# EasyEDA Pro project TTMT_ENTIRE_EASYEDA_PROJECT.epro, schematic panelschematic, sheet 1 of 3

## Sheets
1 P1: Board Name: panel; Create Date: 2026-05-15; Page Name: P1; Project Name: To The Moon Together - An Amateur Sounding Rocket; Schematic Name: panelschematic; Update Date: 2026-05-14; Company: EasyEDA.com; Page Size: A4; Version: V1.0
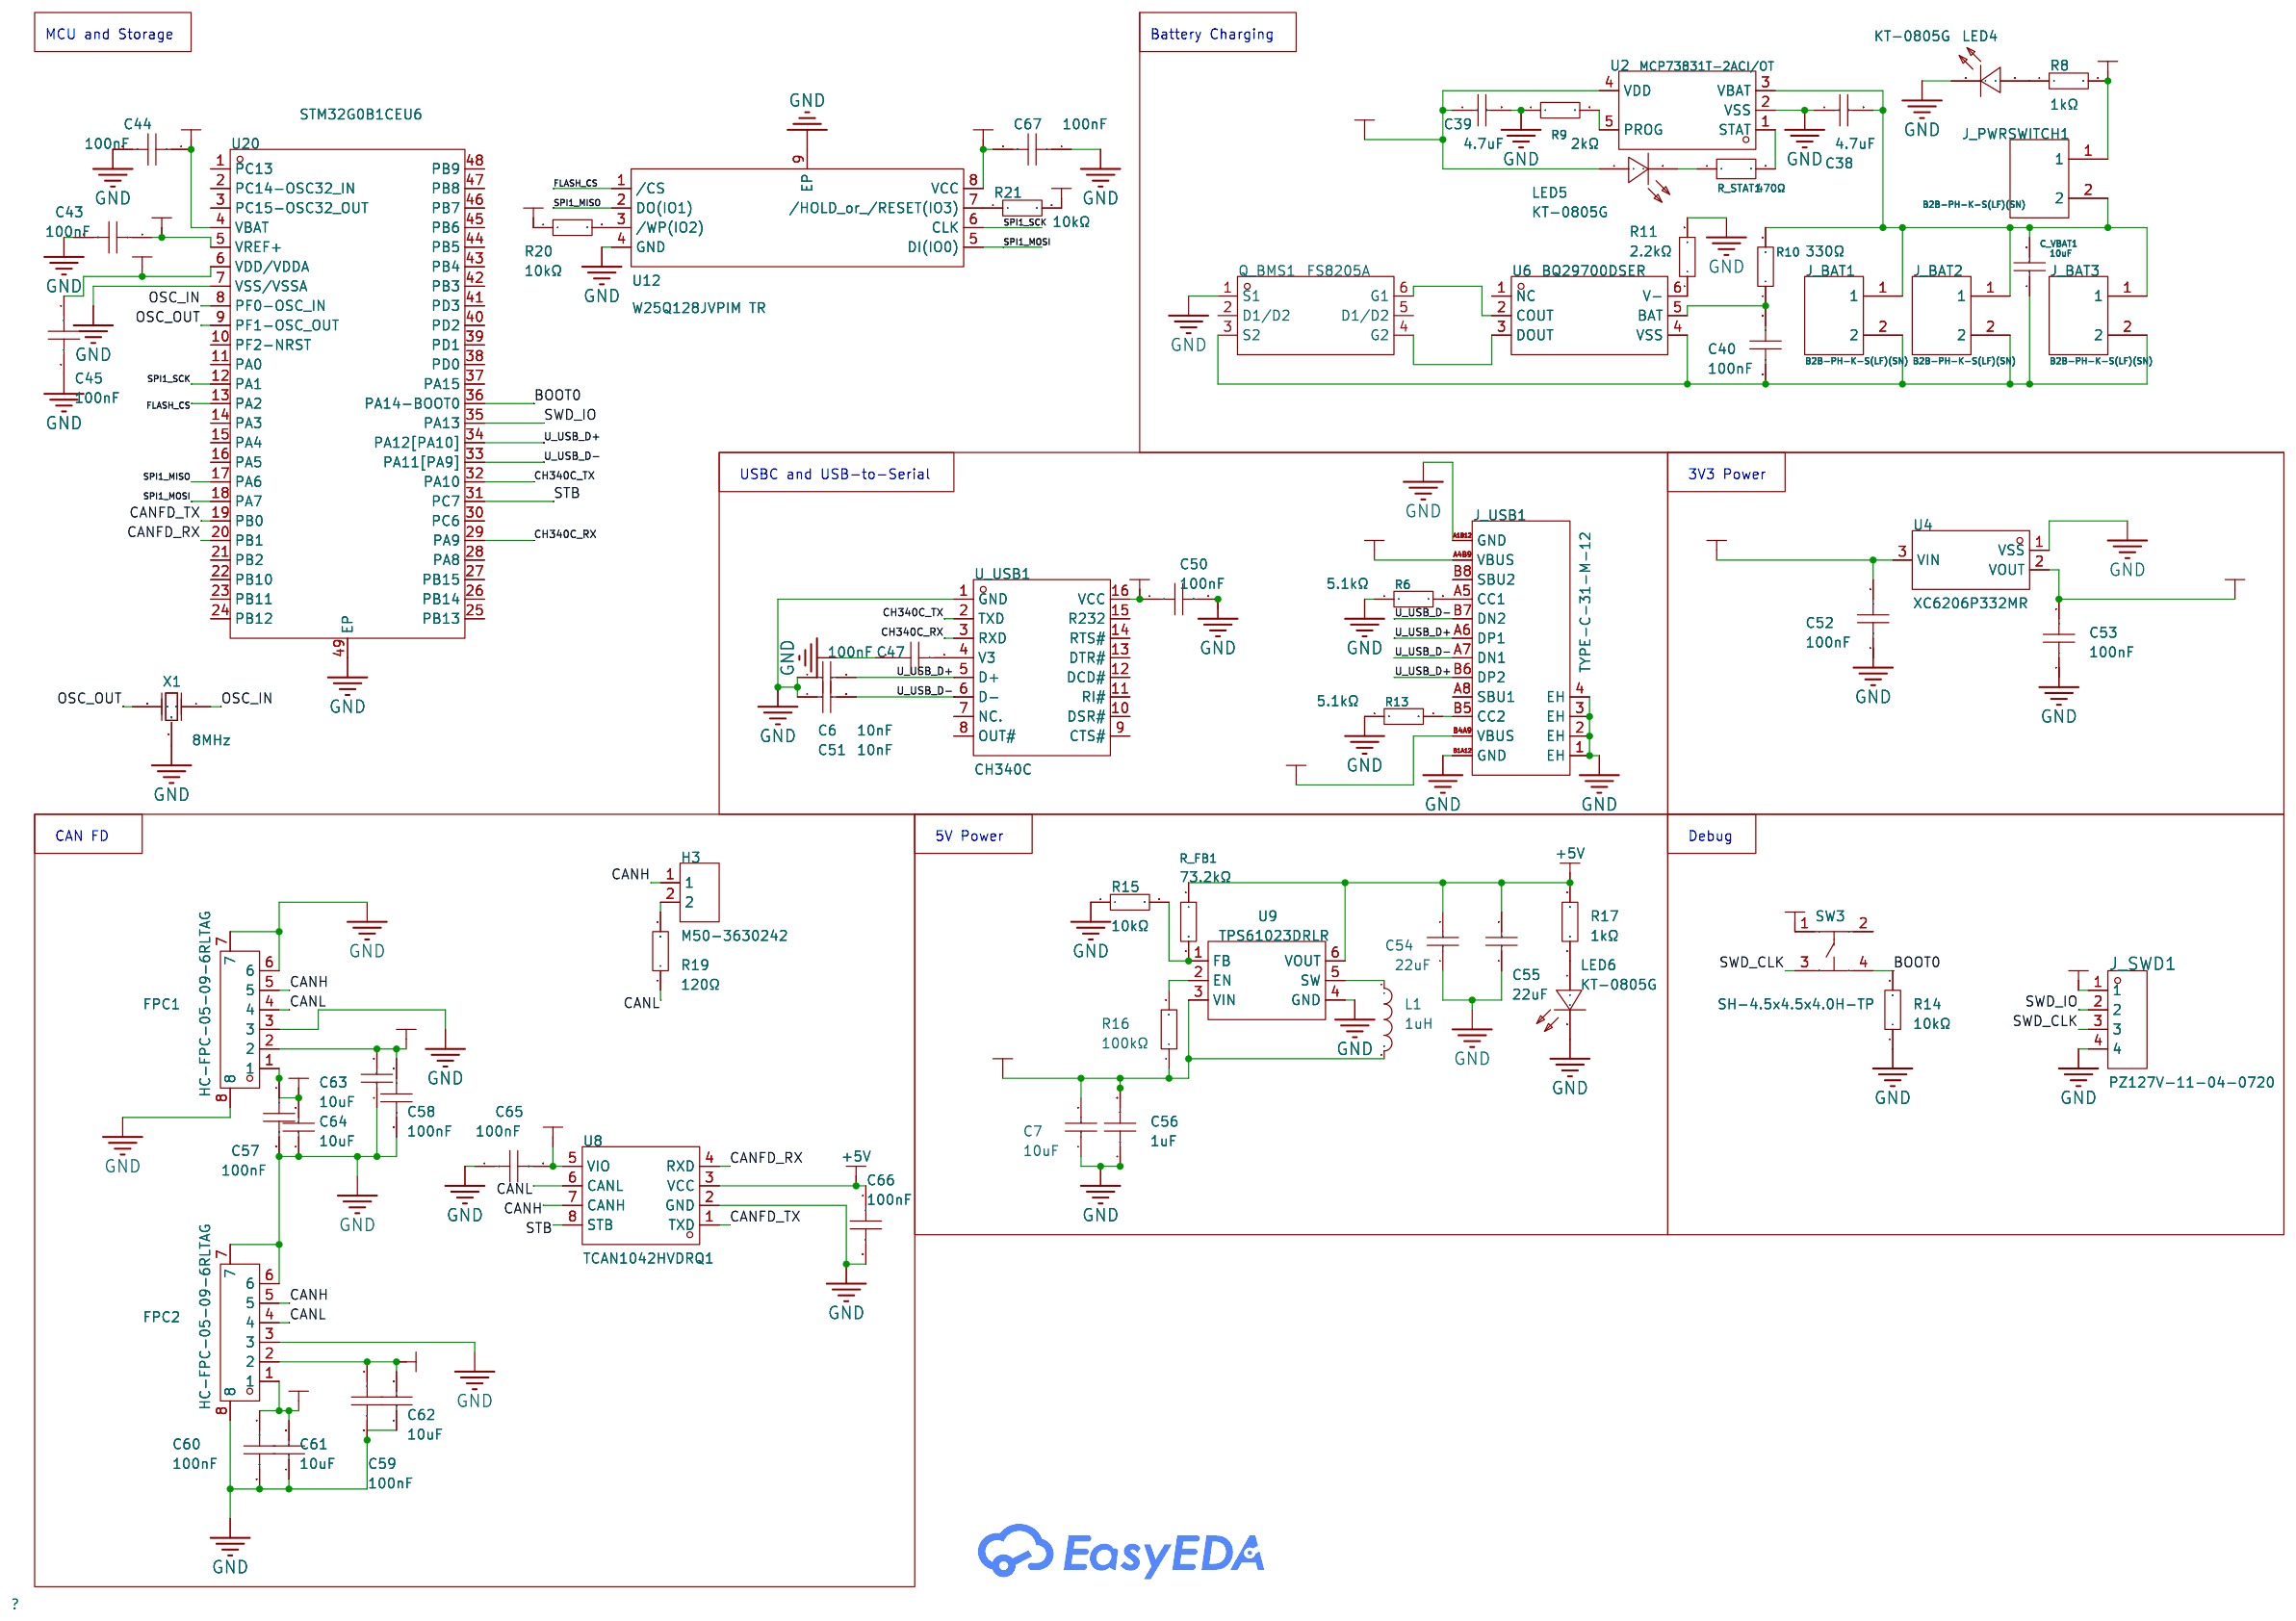
[diagram p5: P1]

## Parts
C6  10nF  [C0402]
C7  10uF  [C0402]
C38  4.7uF  [C1206]
C39  4.7uF  [C1206]
C40  100nF  [C0402]
C43  100nF  [C0402]
C44  100nF  [C0402]
C45  100nF  [C0402]
C47  100nF  [C0402]
C50  100nF  [C0402]
C51  10nF  [C0402]
C52  100nF  [C0402]
C53  100nF  [C0402]
C54  22uF  [C1206]
C55  22uF  [C1206]
C56  1uF  [C0402]
C57  100nF  [C0402]
C58  100nF  [C0402]
C59  100nF  [C0402]
C60  100nF  [C0402]
C61  10uF  [C0402]
C62  10uF  [C0402]
C63  10uF  [C0402]
C64  10uF  [C0402]
C65  100nF  [C0402]
C66  100nF  [C0402]
C67  100nF  [C0402]
C_VBAT1  10uF  [C0402]
FPC1  HC-FPC-05-09-6RLTAG  [FPC-SMD_6P-P0.50_HC-FPC-05-09-6RLTAG]
FPC2  HC-FPC-05-09-6RLTAG  [FPC-SMD_6P-P0.50_HC-FPC-05-09-6RLTAG]
H3  M50-3630242  [HDR-SMD_2P-P1.27_M50-3630242]
J_BAT1  B2B-PH-K-S(LF)(SN)  [CONN-TH_B2B-PH-K-S]
J_BAT2  B2B-PH-K-S(LF)(SN)  [CONN-TH_B2B-PH-K-S]
J_BAT3  B2B-PH-K-S(LF)(SN)  [CONN-TH_B2B-PH-K-S]
J_PWRSWITCH1  B2B-PH-K-S(LF)(SN)  [CONN-TH_B2B-PH-K-S]
J_SWD1  PZ127V-11-04-0720  [HDR-TH_4P-P1.27-V-M]
J_USB1  TYPE-C-31-M-12  [USB-C_SMD-TYPE-C-31-M-12_1]
L1  1uH  [L0603]
LED4  KT-0805G  [LED0805-R-RD]
LED5  KT-0805G  [LED0805-R-RD]
LED6  KT-0805G  [LED0805-R-RD]
Q_BMS1  FS8205A  [SOT-23-6_L2.9-W1.6-P0.95-LS2.8-BR]
R6  5.1kΩ  [R0402]
R8  1kΩ  [R0402]
R9  2kΩ  [R0402]
R10  330Ω  [R0805]
R11  2.2kΩ  [R0805]
R13  5.1kΩ  [R0402]
R14  10kΩ  [R0402]
R15  10kΩ  [R0402]
R16  100kΩ  [R1206]
R17  1kΩ  [R0402]
R19  120Ω  [R0402]
R20  10kΩ  [R0402]
R21  10kΩ  [R0402]
R_FB1  73.2kΩ  [R0402]
R_STAT1  470Ω  [R0402]
SW3  SH-4.5x4.5x4.0H-TP  [SW-SMD_4P-SH-4.5X4.5X4.0H-TP]
U2  MCP73831T-2ACI/OT  [SOT-23-5_L3.0-W1.7-P0.95-LS2.8-BL]
U4  XC6206P332MR  [SOT-23-3_L3.0-W1.7-P0.95-LS2.9-BR]
U6  BQ29700DSER  [WSON-6_L1.5-W1.5-P0.50-TL]
U8  TCAN1042HVDRQ1  [SOIC-8_L4.9-W3.9-P1.27-LS6.0-BL]
U9  TPS61023DRLR  [SOT-563_L1.6-W1.2-P0.50-LS1.6-BR]
U12  W25Q128JVPIM TR  [WSON-8_L6.0-W5.0-P1.27-BL-EP]
U20  STM32G0B1CEU6  [UFQFPN-48_L7.0-W7.0-P0.50-BL-EP]
U_USB1  CH340C  [SOP-16_L10.0-W3.9-P1.27-LS6.0-BL]
X1  8MHz  [OSC-SMD_3P-L3.2-W1.3-P1.20-L]

## Library data of the parts
C6 C51 = CL05B103KB5NNNC: Capacitance:10nF Tolerance:±10% Tolerance:±10% Voltage Rating:50V Temperature Coefficient:X7R; LCSC Part Name: 10nF ±10% 50V; Supplier Part: C15195; Manufacturer: SAMSUNG(三星); Supplier Footprint: 0402; JLCPCB Part Class: Basic Part; Datasheet: https://item.szlcsc.com/datasheet/CL05B103KB5NNNC/15869.html; Supplier: LCSC; Tolerance: ±10%; Voltage Rating: 50V; Temperature Coefficient: X7R
C7 C61-C64 C_VBAT1 = CL05A106MQ5NUNC: Capacitance:10uF Tolerance:±20% Tolerance:±20% Voltage Rating:6.3V Temperature Coefficient:X5R; LCSC Part Name: 10uF ±20% 6.3V; Supplier Part: C15525; Manufacturer: SAMSUNG(三星); Supplier Footprint: 0402; JLCPCB Part Class: Basic Part; Datasheet: https://item.szlcsc.com/datasheet/CL05A106MQ5NUNC/16204.html; Supplier: LCSC; Tolerance: ±20%; Voltage Rating: 6.3V; Temperature Coefficient: X5R
C38 C39 = CL31B475KAHNNNE: Capacitance:4.7uF Tolerance:±10% Tolerance:±10% Voltage Rating:25V Temperature Coefficient:X7R; LCSC Part Name: 4.7uF ±10% 25V; Supplier Part: C1872; Manufacturer: SAMSUNG(三星); Supplier Footprint: 1206; JLCPCB Part Class: Extended Part; Datasheet: https://item.szlcsc.com/datasheet/CL31B475KAHNNNE/2224.html; Supplier: LCSC; Tolerance: ±10%; Voltage Rating: 25V; Temperature Coefficient: X7R
C40 C43-C45 C47 C50 C52 C53 C57-C60 C65-C67 = CL05B104KO5NNNC: Capacitance:100nF Tolerance:±10% Tolerance:±10% Voltage Rating:16V Temperature Coefficient:X7R; LCSC Part Name: 100nF ±10% 16V; Supplier Part: C1525; Manufacturer: SAMSUNG(三星); Supplier Footprint: 0402; JLCPCB Part Class: Basic Part; Datasheet: https://item.szlcsc.com/datasheet/CL05B104KO5NNNC/1877.html; Supplier: LCSC; Tolerance: ±10%; Voltage Rating: 16V; Temperature Coefficient: X7R
C54 C55 = CL31A226KAHNNNE: Capacitance:22uF Tolerance:±10% Tolerance:±10% Voltage Rating:25V Temperature Coefficient:X5R; LCSC Part Name: 22uF ±10% 25V; Supplier Part: C12891; Manufacturer: SAMSUNG(三星); Supplier Footprint: 1206; JLCPCB Part Class: Basic Part; Datasheet: https://item.szlcsc.com/datasheet/CL31A226KAHNNNE/13537.html; Supplier: LCSC; Tolerance: ±10%; Voltage Rating: 25V; Temperature Coefficient: X5R
C56 = CL05A105KA5NQNC: Capacitance:1uF Tolerance:±10% Tolerance:±10% Voltage Rating:25V Temperature Coefficient:X5R; LCSC Part Name: 1uF ±10% 25V; Supplier Part: C52923; Manufacturer: SAMSUNG(三星); Supplier Footprint: 0402; JLCPCB Part Class: Basic Part; Datasheet: https://item.szlcsc.com/datasheet/CL05A105KA5NQNC/53938.html; Supplier: LCSC; Tolerance: ±10%; Voltage Rating: 25V; Temperature Coefficient: X5R
FPC1 FPC2 = HC-FPC-05-09-6RLTAG: Locking Feature:Hinged Lid Contact Type:Double-Sided Contacts, Top and Bottom Entry Number of Contacts:6P Pitch:0.5mm Mounting Type:Surface Mount, Right Angle FFC, FCB Thickness:0.3mm FFC, FCB Thickness:0.3mm Height Above Board:1mm Contact Material:Copper; LCSC Part Name: 翻盖式 双侧触点/上下接 P数:6P 间距:0.5mm; Supplier Part: C5213748; Manufacturer: HCTL(华灿天禄); Supplier Footprint: SMD,P=0.5mm,卧贴; JLCPCB Part Class: Extended Part; Datasheet: https://item.szlcsc.com/datasheet/HC-FPC-05-09-6RLTAG/5909040.html; Supplier: LCSC; Locking Feature: Hinged Lid; Contact Type: Double-Sided Contacts, Top and Bottom Entry; Number of Contacts: 6P; Pitch: 0.5mm; Mounting Type: Surface Mount, Right Angle; FFC, FCB Thickness: 0.3mm; Height Above Board: 1mm; Contact Material: Copper Alloy; Operating Temperature: -55℃~+85℃
H3 = M50-3630242: Pitch:1.27mm Row Spacing:- Circluar Pins/Square Pins:Pin Header Mounting Type:Surface Mount,Vertical Number of Rows:1 Number of Pins:2P Current Rating:1A Length of Mating Pin:3mm Insulation Height:1mm Length of End Connection Pin:- Contact Material:Brass; LCSC Part Name: 间距:1.27mm 方针 立贴; Supplier Part: C7297891; Manufacturer: Harwin; Supplier Footprint: SMD,P=1.27mm; JLCPCB Part Class: Extended Part; Datasheet: https://item.szlcsc.com/datasheet/M50-3630242/8267898.html; Supplier: LCSC; Pitch: 1.27mm; Circluar Pins/Square Pins: Pin Header; Mounting Type: Surface Mount,Vertical; Number of Rows: 1; Number of Pins: 2P; Current Rating: 1A; Length of Mating Pin: 3mm; Insulation Height: 1mm; Contact Material: Brass; Contact Plating: Tin; Operating Temperature: -40℃~+105℃; Color: Black
J_BAT1-J_BAT3 J_PWRSWITCH1 = B2B-PH-K-S(LF)(SN): Pins Structure:1x2P Pitch:2mm Mounting Type:Through Hole Reference Series:PH Number of Pins:2P Number of Rows:1 Number of PINs Per Row:2 Row Spacing:- Current Rating:2A Contact Material:Brass Contact Plating:Tin Operating Temperature:-25℃~+85℃ Operating T; LCSC Part Name: 1x2P 间距:2mm 直插 系列:PH; Supplier Part: C131337; Manufacturer: JST; Supplier Footprint: 插件,P=2mm; JLCPCB Part Class: Extended Part; Datasheet: https://item.szlcsc.com/datasheet/B2B-PH-K-S(LF)(SN)/142630.html; Supplier: LCSC; Pins Structure: 1x2P; Pitch: 2mm; Mounting Type: Through Hole; Reference Series: PH; Number of Pins: 2P; Number of Rows: 1; Number of PINs Per Row: 2; Current Rating: 2A; Contact Material: Brass; Contact Plating: Tin; Operating Temperature: -25℃~+85℃; Voltage Rating: 100V; Plastic Material: PA66; Flame Retardant Rating: UL94V-0; Supplementary Features: K Pin; Color: White; Z-Height of the Board: 6mm; X-Length of Bottom Edge on Board (Spacing Line): 5.9mm; Y-Width of Bottom Edge on Board: 4.5mm
J_SWD1 = PZ127V-11-04-0720: Pin Structure:1x4P Pitch:1.27mm Row Spacing:- Circluar Pins/Square Pins:Pin Header Mounting Type:Through Hole Number of Rows:1 Number of Pins:4P Current Rating:1A Voltage Rating (Max):- Length of Mating Pin:3.9mm Insulation Height:1mm Length of End Connec; LCSC Part Name: 1x4P 间距:1.27mm 方针 直插; Supplier Part: C541879; Manufacturer: XFCN(兴飞); Supplier Footprint: 插件,P=1.27mm; JLCPCB Part Class: Extended Part; Datasheet: https://item.szlcsc.com/datasheet/PZ127V-11-04-0720/562500.html; Supplier: LCSC; Pin Structure: 1x4P; Pitch: 1.27mm; Circluar Pins/Square Pins: Pin Header; Mounting Type: Through Hole; Number of Rows: 1; Number of Pins: 4P; Current Rating: 1A; Length of Mating Pin: 3.9mm; Insulation Height: 1mm; Length of End Connection Pin: 2.3mm; Contact Material: Brass; Operating Temperature: -40℃~+105℃; Color: Black
J_USB1 = TYPE-C-31-M-12: Connector Type:Type-C Protocol Standard:- Gender:Female Mounting Type:Surface Mount, Right Angle Number of Contacts:16P Number of Ports:1 Current Rating-Power:5A Voltage Rating:20V Connect-Disconnect Life:10,000 cycles Length:7.35mm Operating Temperature:; LCSC Part Name: Type-C 母 卧贴; Supplier Part: C165948; Manufacturer: 韩国韩荣; Supplier Footprint: SMD; JLCPCB Part Class: Extended Part; Datasheet: https://item.szlcsc.com/datasheet/TYPE-C-31-M-12/177331.html; Supplier: LCSC; Connector Type: Type-C; Gender: Female; Mounting Type: Surface Mount, Right Angle; Number of Contacts: 16P; Number of Ports: 1; Current Rating-Power: 5A; Voltage Rating: 20V; Connect-Disconnect Life: 10,000 cycles; Length: 7.35mm; Operating Temperature: -30℃~+80℃
L1 = YL160808-1R0K: Inductance:1uH Tolerance:±10% Tolerance:±10% Current Rating:25mA Current - Saturation (Isat):- DC Resistance(DCR):600mΩ Q @ Frequency:35@10MHz Frequency - Self Resonant:75MHz Ratings:-; LCSC Part Name: 1uH ±10%; Supplier Part: C2839970; Manufacturer: YJYCOIN(益嘉源); Supplier Footprint: 0603; JLCPCB Part Class: Extended Part; Datasheet: https://item.szlcsc.com/datasheet/YL160808-1R0K/3017530.html; Supplier: LCSC; Tolerance: ±10%; Current Rating: 25mA; DC Resistance(DCR): 600mΩ; Q @ Frequency: 35@10MHz; Frequency - Self Resonant: 75MHz
LED4-LED6 = KT-0805G: Lamp Holder Type:- Illumination Color:Emerald Green Voltage - Forward(Vf):2.6V~3.1V Voltage - Forward(Vf):2.6V~3.1V Power(Watts):100mW Forward Current:5mA Wavelength - Dominant:513nm~528nm Wavelength - Dominant:513nm~528nm Peak Wavelength:525nm Diode Conf; LCSC Part Name: 0805 翠绿 高亮; Supplier Part: C2297; Manufacturer: KENTO; Supplier Footprint: 0805; JLCPCB Part Class: Basic Part; Datasheet: https://item.szlcsc.com/datasheet/KT-0805G/2670.html; Supplier: LCSC; Illumination Color: Emerald Green; Voltage - Forward(Vf): 2.6V~3.1V; Power(Watts): 100mW; Forward Current: 5mA; Wavelength - Dominant: 513nm~528nm; Peak Wavelength: 525nm; Diode Configuration: Discrete Diode; Lens Color: Water Clear; Luminous Intensity: 430mcd; Viewing Angle: 120°; Operating Temperature: -40℃~+85℃
Q_BMS1 = FS8205A_C2830320: Type:2 N-Channel Drain Source Voltage (Vdss): Continuous Drain Current (Id): Drain Source On Resistance (RDS(on)@Vgs,Id):25mΩ@2.5V,3A Power Dissipation (Pd): Gate Threshold Voltage (Vgs(th)@Id):500mV@250uA Total Gate Charge (Qg@Vgs):5.7nC@10V Input Capaci; LCSC Part Name: 2个N沟道 耐压:20V 电流:6A; Supplier Part: C2830320; Manufacturer: TECH PUBLIC(台舟); Supplier Footprint: SOT-23-6; JLCPCB Part Class: Extended Part; Datasheet: https://atta.szlcsc.com/upload/public/pdf/source/20210810/F53B6D4E8755A1F8E11BAF814CE98E6A.pdf; Supplier: LCSC; Type: 2 N-Channel; Drain Source On Resistance (RDS(on)@Vgs,Id): 25mΩ@2.5V,3A; Gate Threshold Voltage (Vgs(th)@Id): 500mV@250uA; Total Gate Charge (Qg@Vgs): 5.7nC@10V; Input Capacitance (Ciss@Vds): 466pF@10V; Reverse Transfer Capacitance (Crss@Vds): 58pF@10V; Operating Temperature: -55℃~+150℃
R6 R13 = 0402WGF5101TCE: Type:Thick Film Resistor Resistance:5.1kΩ Tolerance:±1% Tolerance:±1% Power(Watts):62.5mW Voltage-Supply(Max):50V Temperature Coefficient:±100ppm/℃ Temperature Coefficient:±100ppm/℃ Operating Temperature:-55℃~+155℃ Operating Temperature:-55℃~+155℃; LCSC Part Name: 5.1kΩ ±1% 62.5mW 厚膜电阻; Supplier Part: C25905; Manufacturer: UNI-ROYAL(厚声); Supplier Footprint: 0402; JLCPCB Part Class: Basic Part; Datasheet: https://item.szlcsc.com/datasheet/0402WGF5101TCE/26648.html; Supplier: LCSC; Type: Thick Film Resistor; Tolerance: ±1%; Power(Watts): 62.5mW; Voltage-Supply(Max): 50V; Temperature Coefficient: ±100ppm/℃; Operating Temperature: -55℃~+155℃
R8 R17 = 0402WGF1001TCE: Type:Thick Film Resistor Resistance:1kΩ Tolerance:±1% Tolerance:±1% Power(Watts):62.5mW Voltage-Supply(Max):50V Temperature Coefficient:±100ppm/℃ Temperature Coefficient:±100ppm/℃ Operating Temperature:-55℃~+155℃ Operating Temperature:-55℃~+155℃; LCSC Part Name: 1kΩ ±1% 62.5mW 厚膜电阻; Supplier Part: C11702; Manufacturer: UNI-ROYAL(厚声); Supplier Footprint: 0402; JLCPCB Part Class: Basic Part; Datasheet: https://item.szlcsc.com/datasheet/0402WGF1001TCE/12256.html; Supplier: LCSC; Type: Thick Film Resistor; Tolerance: ±1%; Power(Watts): 62.5mW; Voltage-Supply(Max): 50V; Temperature Coefficient: ±100ppm/℃; Operating Temperature: -55℃~+155℃
R9 = 0402WGF2001TCE: Type:Thick Film Resistors Resistance:2kΩ Tolerance:±1% Tolerance:±1% Power(Watts): Overload Voltage (Max): Temperature Coefficient:±100ppm/℃ Temperature Coefficient:±100ppm/℃ Operating Temperature Range:-55℃~+155℃ Operating Temperature Range:-55℃~+155℃; LCSC Part Name: 2kΩ ±1% 62.5mW 厚膜电阻; Supplier Part: C4109; Manufacturer: UNI-ROYAL(厚声); Supplier Footprint: 0402; JLCPCB Part Class: Basic Part; Datasheet: https://atta.szlcsc.com/upload/public/pdf/source/20200306/C422600_1E6D84923E4A46A82E41ADD87F860B5C.pdf; Supplier: LCSC; Type: Thick Film Resistors; Tolerance: ±1%; Temperature Coefficient: ±100ppm/℃; Operating Temperature Range: -55℃~+155℃
R10 = 0805W8F3300T5E: Type:Thick Film Resistor Resistance:330Ω Tolerance:±1% Tolerance:±1% Power(Watts):125mW Voltage-Supply(Max):150V Temperature Coefficient:±100ppm/℃ Temperature Coefficient:±100ppm/℃ Operating Temperature:-55℃~+155℃ Operating Temperature:-55℃~+155℃; LCSC Part Name: 330Ω ±1% 125mW 厚膜电阻; Supplier Part: C17630; Manufacturer: UNI-ROYAL(厚声); Supplier Footprint: 0805; JLCPCB Part Class: Basic Part; Datasheet: https://item.szlcsc.com/datasheet/0805W8F3300T5E/18318.html; Supplier: LCSC; Type: Thick Film Resistor; Tolerance: ±1%; Power(Watts): 125mW; Voltage-Supply(Max): 150V; Temperature Coefficient: ±100ppm/℃; Operating Temperature: -55℃~+155℃
R11 = 0805W8F2201T5E_C17520: Type:Thick Film Resistor Resistance:2.2kΩ Tolerance:±1% Tolerance:±1% Power(Watts):125mW Voltage-Supply(Max):150V Temperature Coefficient:±100ppm/℃ Temperature Coefficient:±100ppm/℃ Operating Temperature:-55℃~+155℃ Operating Temperature:-55℃~+155℃; LCSC Part Name: 2.2kΩ ±1% 125mW 厚膜电阻; Supplier Part: C17520; Manufacturer: UNI-ROYAL(厚声); Manufacturer Part: 0805W8F2201T5E; Supplier Footprint: 0805; JLCPCB Part Class: Basic Part; Datasheet: https://item.szlcsc.com/datasheet/0805W8F2201T5E/18208.html; Supplier: LCSC; Type: Thick Film Resistor; Tolerance: ±1%; Power(Watts): 125mW; Voltage-Supply(Max): 150V; Temperature Coefficient: ±100ppm/℃; Operating Temperature: -55℃~+155℃
R14 R15 R20 R21 = 0402WGF1002TCE: Type:Thick Film Resistor Resistance:10kΩ Tolerance:±1% Tolerance:±1% Power(Watts):62.5mW Voltage-Supply(Max):50V Temperature Coefficient:±100ppm/℃ Temperature Coefficient:±100ppm/℃ Operating Temperature:-55℃~+155℃ Operating Temperature:-55℃~+155℃; LCSC Part Name: 10kΩ ±1% 62.5mW 厚膜电阻; Supplier Part: C25744; Manufacturer: UNI-ROYAL(厚声); Supplier Footprint: 0402; JLCPCB Part Class: Basic Part; Datasheet: https://item.szlcsc.com/datasheet/0402WGF1002TCE/26487.html; Supplier: LCSC; Type: Thick Film Resistor; Tolerance: ±1%; Power(Watts): 62.5mW; Voltage-Supply(Max): 50V; Temperature Coefficient: ±100ppm/℃; Operating Temperature: -55℃~+155℃
R16 = 1206W4F1003T5E: Type:Thick Film Resistor Resistance:100kΩ Tolerance:±1% Tolerance:±1% Power(Watts):250mW Voltage-Supply(Max):200V Temperature Coefficient:±100ppm/℃ Temperature Coefficient:±100ppm/℃ Operating Temperature:-55℃~+155℃ Operating Temperature:-55℃~+155℃; LCSC Part Name: 100kΩ ±1% 250mW 厚膜电阻; Supplier Part: C17900; Manufacturer: UNI-ROYAL(厚声); Supplier Footprint: 1206; JLCPCB Part Class: Basic Part; Datasheet: https://item.szlcsc.com/datasheet/1206W4F1003T5E/18588.html; Supplier: LCSC; Type: Thick Film Resistor; Tolerance: ±1%; Power(Watts): 250mW; Voltage-Supply(Max): 200V; Temperature Coefficient: ±100ppm/℃; Operating Temperature: -55℃~+155℃
R19 = 0402WGF1200TCE: Type:Thick Film Resistor Resistance:120Ω Tolerance:±1% Tolerance:±1% Power(Watts):62.5mW Voltage-Supply(Max):50V Temperature Coefficient:±100ppm/℃ Temperature Coefficient:±100ppm/℃ Operating Temperature:-55℃~+155℃ Operating Temperature:-55℃~+155℃; LCSC Part Name: 120Ω ±1% 62.5mW 厚膜电阻; Supplier Part: C25079; Manufacturer: UNI-ROYAL(厚声); Supplier Footprint: 0402; JLCPCB Part Class: Basic Part; Datasheet: https://item.szlcsc.com/datasheet/0402WGF1200TCE/25822.html; Supplier: LCSC; Type: Thick Film Resistor; Tolerance: ±1%; Power(Watts): 62.5mW; Voltage-Supply(Max): 50V; Temperature Coefficient: ±100ppm/℃; Operating Temperature: -55℃~+155℃
R_FB1 = 0402WGF7322TCE: Type:Thick Film Resistor Resistance:73.2kΩ Tolerance:±1% Tolerance:±1% Power(Watts):62.5mW Voltage-Supply(Max):50V Temperature Coefficient:±100ppm/℃ Temperature Coefficient:±100ppm/℃ Operating Temperature:-55℃~+155℃ Operating Temperature:-55℃~+155℃; LCSC Part Name: 73.2kΩ ±1% 62.5mW 厚膜电阻; Supplier Part: C26986; Manufacturer: UNI-ROYAL(厚声); Supplier Footprint: 0402; JLCPCB Part Class: Extended Part; Datasheet: https://item.szlcsc.com/datasheet/0402WGF7322TCE/27735.html; Supplier: LCSC; Type: Thick Film Resistor; Tolerance: ±1%; Power(Watts): 62.5mW; Voltage-Supply(Max): 50V; Temperature Coefficient: ±100ppm/℃; Operating Temperature: -55℃~+155℃
R_STAT1 = FRC0402F4700TS: Type:Thick Film Resistor Resistance:470Ω Tolerance:±1% Tolerance:±1% Power(Watts):62.5mW Voltage-Supply(Max):50V Temperature Coefficient:±100ppm/℃ Temperature Coefficient:±100ppm/℃ Operating Temperature:-55℃~+155℃ Operating Temperature:-55℃~+155℃; LCSC Part Name: 470Ω ±1% 62.5mW 厚膜电阻; Supplier Part: C2909361; Manufacturer: FOJAN(富捷); Supplier Footprint: 0402; JLCPCB Part Class: Extended Part; Supplier: LCSC; Type: Thick Film Resistor; Tolerance: ±1%; Power(Watts): 62.5mW; Voltage-Supply(Max): 50V; Temperature Coefficient: ±100ppm/℃; Operating Temperature: -55℃~+155℃
SW3 = SH-4.5x4.5x4.0H-TP: LCSC Part Name: TS4540TP 250gf编带; Supplier Part: C52092029; Manufacturer: SHOU HAN(首韩); Supplier Footprint: SMD; JLCPCB Part Class: Extended Part; Datasheet: https://item.szlcsc.com/datasheet/SH-4.5x4.5x4.0H-TP/54864053.html; Supplier: LCSC
U2 = MCP73831T-2ACI/OT: The Chip Type:Charging IC Voltage - Supply:3.75V~6V Voltage - Supply:3.75V~6V Charge Current - Max:550mA Charging Saturation Voltage:4.2V End-Off Voltage:- Type of Battery:Lithium Battery Number of Cells:1 Number of Cells:1 Operating Temperature:-40℃~+85℃; LCSC Part Name: 单节锂离子/锂聚合物充电管理控制器; Supplier Part: C424093; Manufacturer: MICROCHIP(美国微芯); Supplier Footprint: SOT-23-5; JLCPCB Part Class: Extended Part; Datasheet: https://item.szlcsc.com/datasheet/MCP73831T-2ACI%252FOT/417116.html; Supplier: LCSC; The Chip Type: Charging IC; Voltage - Supply: 3.75V~6V; Charge Current - Max: 550mA; Charging Saturation Voltage: 4.2V; Type of Battery: Lithium Battery; Number of Cells: 1; Operating Temperature: -40℃~+85℃; Battery Temperature Detection: Not supported; Supply Current (Iq): 53uA
U4 = XC6206P332MR_C347376: Output Type:Fixed Voltage - Supply:8V Output Voltage:3.3V Output Voltage:3.3V Output Current:250mA Power Supply Rejection Ratio (PSRR):40dB@(1kHz) Voltage Dropout:240mV@(50mA) standby current:7uA Noise:- Features:Over Current Protection；Short Circuit Prot; LCSC Part Name: 高纹波抑制率、低功耗、低压差 CMOS 降压型电压稳压器; Supplier Part: C347376; Manufacturer: UMW(友台半导体); Supplier Footprint: SOT-23; JLCPCB Part Class: Extended Part; Datasheet: https://item.szlcsc.com/datasheet/XC6206P332MR/324036.html; Supplier: LCSC; Output Type: Fixed; Voltage - Supply: 8V; Output Voltage: 3.3V; Output Current: 250mA; Power Supply Rejection Ratio (PSRR): 40dB@(1kHz); Voltage Dropout: 240mV@(50mA); standby current: 7uA; Features: Over Current Protection；Short Circuit Protection; Operating Temperature: -25℃~+80℃@(Ta); Output Configuration: Positive; Number of Outputs: 1
U6 = BQ29700DSER: The Chip Type:Protection IC Voltage - Supply:1.5V~8V Voltage - Supply:1.5V~8V Charge Current - Max:- Charging Saturation Voltage:4.275V End-Off Voltage:2.8V Type of Battery:Lithium Battery Number of Cells:1 Number of Cells:1 Operating Temperature:-40℃~+85; LCSC Part Name: 单节锂离子和锂聚合物电池的经济型电压和电流保护集成电路; Supplier Part: C183096; Manufacturer: TI(德州仪器); Supplier Footprint: WSON-6(1.5x1.5); JLCPCB Part Class: Extended Part; Datasheet: https://www.ti.com/cn/lit/gpn/bq2970; Supplier: LCSC; The Chip Type: Protection IC; Voltage - Supply: 1.5V~8V; Charging Saturation Voltage: 4.275V; End-Off Voltage: 2.8V; Type of Battery: Lithium Battery; Number of Cells: 1; Operating Temperature: -40℃~+85℃; Battery Temperature Detection: Not supported; 0V Battery Charge: Support; Supply Current (Iq): 4uA
U8 = TCAN1042HVDRQ1: Type:CAN FD Transceiver Data Rate:2Mbps Voltage - Supply:4.5V~5.5V Voltage - Supply:4.5V~5.5V Current - Supply:80mA Operating Temperature:-55℃~+125℃ Operating Temperature:-55℃~+125℃ Number of Channels:- Quiescent Supply Current:22uA; LCSC Part Name: TCAN1042-Q1 汽车故障保护 CAN 收发器，带 CAN FD; Supplier Part: C485807; Manufacturer: TI(德州仪器); Supplier Footprint: SOIC-8; JLCPCB Part Class: Extended Part; Datasheet: https://www.ti.com/cn/lit/gpn/tcan1042hv-q1; Supplier: LCSC; Type: CAN FD Transceiver; Data Rate: 2Mbps; Voltage - Supply: 4.5V~5.5V; Current - Supply: 80mA; Operating Temperature: -55℃~+125℃; Quiescent Supply Current: 22uA
U9 = TPS61023DRLR: Function:Boost type Output Type:Adjustable Voltage - Supply:500mV~5.5V Voltage - Supply:500mV~5.5V Output Voltage:2.2V~5.5V Output Voltage:2.2V~5.5V Output Current:3A Frequency - Switching:1MHz Frequency - Switching:1MHz Operating Temperature:-40℃~+125℃@(; Supplier Part: C919459; Manufacturer: TI(德州仪器); Supplier Footprint: SOT-563; JLCPCB Part Class: Extended Part; Datasheet: https://www.ti.com.cn/cn/lit/ds/symlink/tps61023.pdf?ts=1728812468331&ref_url=https%253A%252F%252Fwww.ti.com.cn%252Fproduct%252Fcn%252FTPS61023; Supplier: LCSC; Function: Boost type; Output Type: Adjustable; Voltage - Supply: 500mV~5.5V; Output Voltage: 2.2V~5.5V; Output Current: 3A; Frequency - Switching: 1MHz; Operating Temperature: -40℃~+125℃@(TJ); Synchronous Rectifier: Yes; Number of Outputs: 1; Topology: Boost; Switch tube (built-in/external): Built-in
U12 = W25Q128JVPIM TR: Interface:SPI Memory Size:128Mbit Clock Frequency:133MHz Voltage - Supply:2.7V~3.6V Voltage - Supply:2.7V~3.6V Standby Supply Current:10uA Program / Erase Cycles:100,000 Cycles Page Programming Time (Tpp):3ms Data Retention - TDR (Year):20 Years Operating; LCSC Part Name: 支持双/四路SPI、QPI和DTR，3V、128Mbit 串行闪存; Supplier Part: C2441427; Manufacturer: Winbond(华邦); Supplier Footprint: WSON-8-EP(5x6); JLCPCB Part Class: Extended Part; Datasheet: https://item.szlcsc.com/datasheet/W25Q128JVPIM%2520TR/2533278.html; Supplier: LCSC; Interface: SPI; Memory Size: 128Mbit; Clock Frequency: 133MHz; Voltage - Supply: 2.7V~3.6V; Standby Supply Current: 10uA; Program / Erase Cycles: 100,000 Cycles; Page Programming Time (Tpp): 3ms; Data Retention - TDR (Year): 20 Years; Operating Temperature: -40℃~+85℃
U20 = STM32G0B1CEU6: LCSC Part Name: 主流Arm Cortex-M0+ 32位MCU，最高512KB闪存，144KB内存，6个USART，定时器，ADC，DAC，通信接口，1.7-3.6V; Supplier Part: C2829190; Manufacturer: ST(意法半导体); Supplier Footprint: UFQFPN-48(7x7); JLCPCB Part Class: Extended Part; Datasheet: https://item.szlcsc.com/datasheet/STM32G0B1CEU6/2979251.html; Supplier: LCSC
U_USB1 = CH340C: Applications Function:Transceiver USB Protocol:USB 2.0 Voltage - Supply:3.3V；5V Voltage - Supply:3.3V；5V Data Rate:2Mbps Operating Temperature:-20℃~+70℃ Operating Temperature:-20℃~+70℃ Current - Supply:7mA Supply Current (Iq):50uA; LCSC Part Name: USB转串口芯片; Supplier Part: C84681; Manufacturer: WCH(南京沁恒); Supplier Footprint: SOP-16; JLCPCB Part Class: Extended Part; Datasheet: https://item.szlcsc.com/datasheet/CH340C/85852.html; Supplier: LCSC; Applications Function: Transceiver; USB Protocol: USB 2.0; Voltage - Supply: 3.3V；5V; Data Rate: 2Mbps; Operating Temperature: -20℃~+70℃; Current - Supply: 7mA; Supply Current (Iq): 50uA
X1 = CSTNE8M00GH5C000R0: Frequency:8MHz Built - in Load Capacitance:33pF Resonant Impedance:40Ω Operating Temperature:-40℃~+125℃ Operating Temperature:-40℃~+125℃; LCSC Part Name: 8MHz ±0.07% 内置负载电容:33pF; Supplier Part: C341525; Manufacturer: muRata(村田); Supplier Footprint: SMD3213-3P; JLCPCB Part Class: Extended Part; Datasheet: https://item.szlcsc.com/datasheet/CSTNE8M00GH5C000R0/318917.html; Supplier: LCSC; Built - in Load Capacitance: 33pF; Resonant Impedance: 40Ω; Operating Temperature: -40℃~+125℃

## Nets
3V3: C43.1 C44.1 C45.1 C50.1 C53.2 C57.1 C60.1 C61.2 C64.2 C65.2 C67.2 FPC1.1 FPC2.1 J_SWD1.1 R20.1 R21.2 SW3.1 U4.2(VOUT) U8.5(VIO) U12.8(VCC) U20.4(VBAT) U20.5(VREF+) U20.6(VDD/VDDA) U_USB1.16(VCC) ; also on sheet 2 3
+5V: C54.2 C55.2 C66.1 R17.2 R_FB1.1 U8.3(VCC) U9.6(VOUT) ; also on sheet 2 3
GND: C6.1 C7.1 C38.1 C39.2 C43.2 C44.2 C45.2 C47.1 C50.2 C51.1 C52.1 C53.1 C54.1 C55.1 C56.1 C57.2 C58.2 C59.2 C60.2 C61.1 C62.1 C63.1 C64.1 C65.1 C66.2 C67.1 FPC1.3 FPC1.6 FPC1.7 FPC1.8 FPC2.3 FPC2.6 FPC2.7 FPC2.8 J_SWD1.4 J_USB1.1(EH) J_USB1.2(EH) J_USB1.3(EH) J_USB1.4(EH) J_USB1.A1B12(GND) J_USB1.B1A12(GND) LED4.2(K) LED6.2(K) Q_BMS1.1(S1) R6.1 R9.1 R11.2 R13.1 R14.1 R15.1 U2.2(VSS) U4.1(VSS) U8.2(GND) U9.4(GND) U12.4(GND) U12.9(EP) U20.7(VSS/VSSA) U20.49(EP) U_USB1.1(GND) X1.2(GND) ; also on sheet 2 3
VBAT: C7.2 C52.2 C56.2 C58.1 C59.1 C62.2 C63.2 FPC1.2 FPC2.2 J_PWRSWITCH1.1 L1.2 R8.2 R16.1 U4.3(VIN) U9.3(VIN)
VBUS_5V: C39.1 J_USB1.A4B9(VBUS) J_USB1.B4A9(VBUS) LED5.1(A) U2.4(VDD)
BOOT0: R14.2 SW3.4 U20.36(PA14-BOOT0) ; also on sheet 2 3
CANFD_RX: U8.4(RXD) U20.20(PB1) ; also on sheet 2 3
CANFD_TX: U8.1(TXD) U20.19(PB0) ; also on sheet 2 3
CANH: FPC1.5 FPC2.5 H3.1 U8.7(CANH) ; also on sheet 2 3
CANL: FPC1.4 FPC2.4 R19.1 U8.6(CANL) ; also on sheet 2 3
CH340C_RX: U20.29(PA9) U_USB1.3(RXD)
CH340C_TX: U20.32(PA10) U_USB1.2(TXD)
FLASH_CS: U12.1(/CS) U20.13(PA2)
OSC_IN: U20.8(PF0-OSC_IN) X1.1(OSC1) ; also on sheet 2 3
OSC_OUT: U20.9(PF1-OSC_OUT) X1.3(OSC2) ; also on sheet 2 3
SPI1_MISO: U12.2(DO(IO1)) U20.17(PA6)
SPI1_MOSI: U12.5(DI(IO0)) U20.18(PA7)
SPI1_SCK: U12.6(CLK) U20.12(PA1)
STB: U8.8(STB) U20.31(PC7) ; also on sheet 2 3
SWD_CLK: J_SWD1.3 SW3.3 ; also on sheet 2
SWD_IO: J_SWD1.2 U20.35(PA13) ; also on sheet 2 3
U_USB_D+: C6.2 J_USB1.A6(DP1) J_USB1.B6(DP2) U20.34(PA12[PA10]) U_USB1.5(D+)
U_USB_D-: C51.2 J_USB1.A7(DN1) J_USB1.B7(DN2) U20.33(PA11[PA9]) U_USB1.6(D-)
$1N887: C40.1 C_VBAT1.1 J_BAT1.2 J_BAT2.2 J_BAT3.2 Q_BMS1.3(S2) U6.4(VSS)
$1N890: Q_BMS1.6(G1) U6.2(COUT)
$1N891: C40.2 R10.1 U6.5(BAT)
$1N894: LED5.2(K) R_STAT1.1
$1N895: R_STAT1.2 U2.1(STAT)
$1N897: R9.2 U2.5(PROG)
$1N898: Q_BMS1.4(G2) U6.3(DOUT)
$1N900: C38.2 C_VBAT1.2 J_BAT1.1 J_BAT2.1 J_BAT3.1 J_PWRSWITCH1.2 R10.2 U2.3(VBAT)
$1N3156: J_USB1.B5(CC2) R13.2
$1N8915: R15.2 R_FB1.2 U9.1(FB)
$1N8918: R16.2 U9.2(EN)
$1N19964: LED4.1(A) R8.1
$1N22151: R11.1 U6.6(V-)
$1N22590: C47.2 U_USB1.4(V3)
$1N22735: J_USB1.A5(CC1) R6.2
$1N28064: H3.2 R19.2
Net-(L1-1): L1.1 U9.5(SW)
Net-(LED6-1): LED6.1(A) R17.1
Net-(R20-2): R20.2 U12.3(/WP(IO2))
Net-(R21-1): R21.1 U12.7(/HOLD or /RESET(IO3))

Not connected (* = marked no-connect by the designer): J_USB1 A8(SBU1) B8(SBU2); Q_BMS1 2(D1/D2) 5(D1/D2); SW3 2; U6 1(NC); U20 1(PC13) 2(PC14-OSC32_IN) 3(PC15-OSC32_OUT) 10(PF2-NRST) 11(PA0) 14(PA3) 15(PA4) 16(PA5) 21(PB2) 22(PB10) 23(PB11) 24(PB12) 25(PB13) 26(PB14) 27(PB15) 28(PA8) 30(PC6) 37(PA15) 38(PD0) 39(PD1) 40(PD2) 41(PD3) 42(PB3) 43(PB4) 44(PB5) 45(PB6) 46(PB7) 47(PB8) 48(PB9); U_USB1 7(NC.) 8(OUT#) 9(CTS#) 10(DSR#) 11(RI#) 12(DCD#) 13(DTR#) 14(RTS#) 15(R232)

## Notes on the sheets
sheet 1
- MCU and Storage
- Battery Charging
- USBC and USB-to-Serial
- 3V3 Power
- CAN FD
- 5V Power
- Debug
